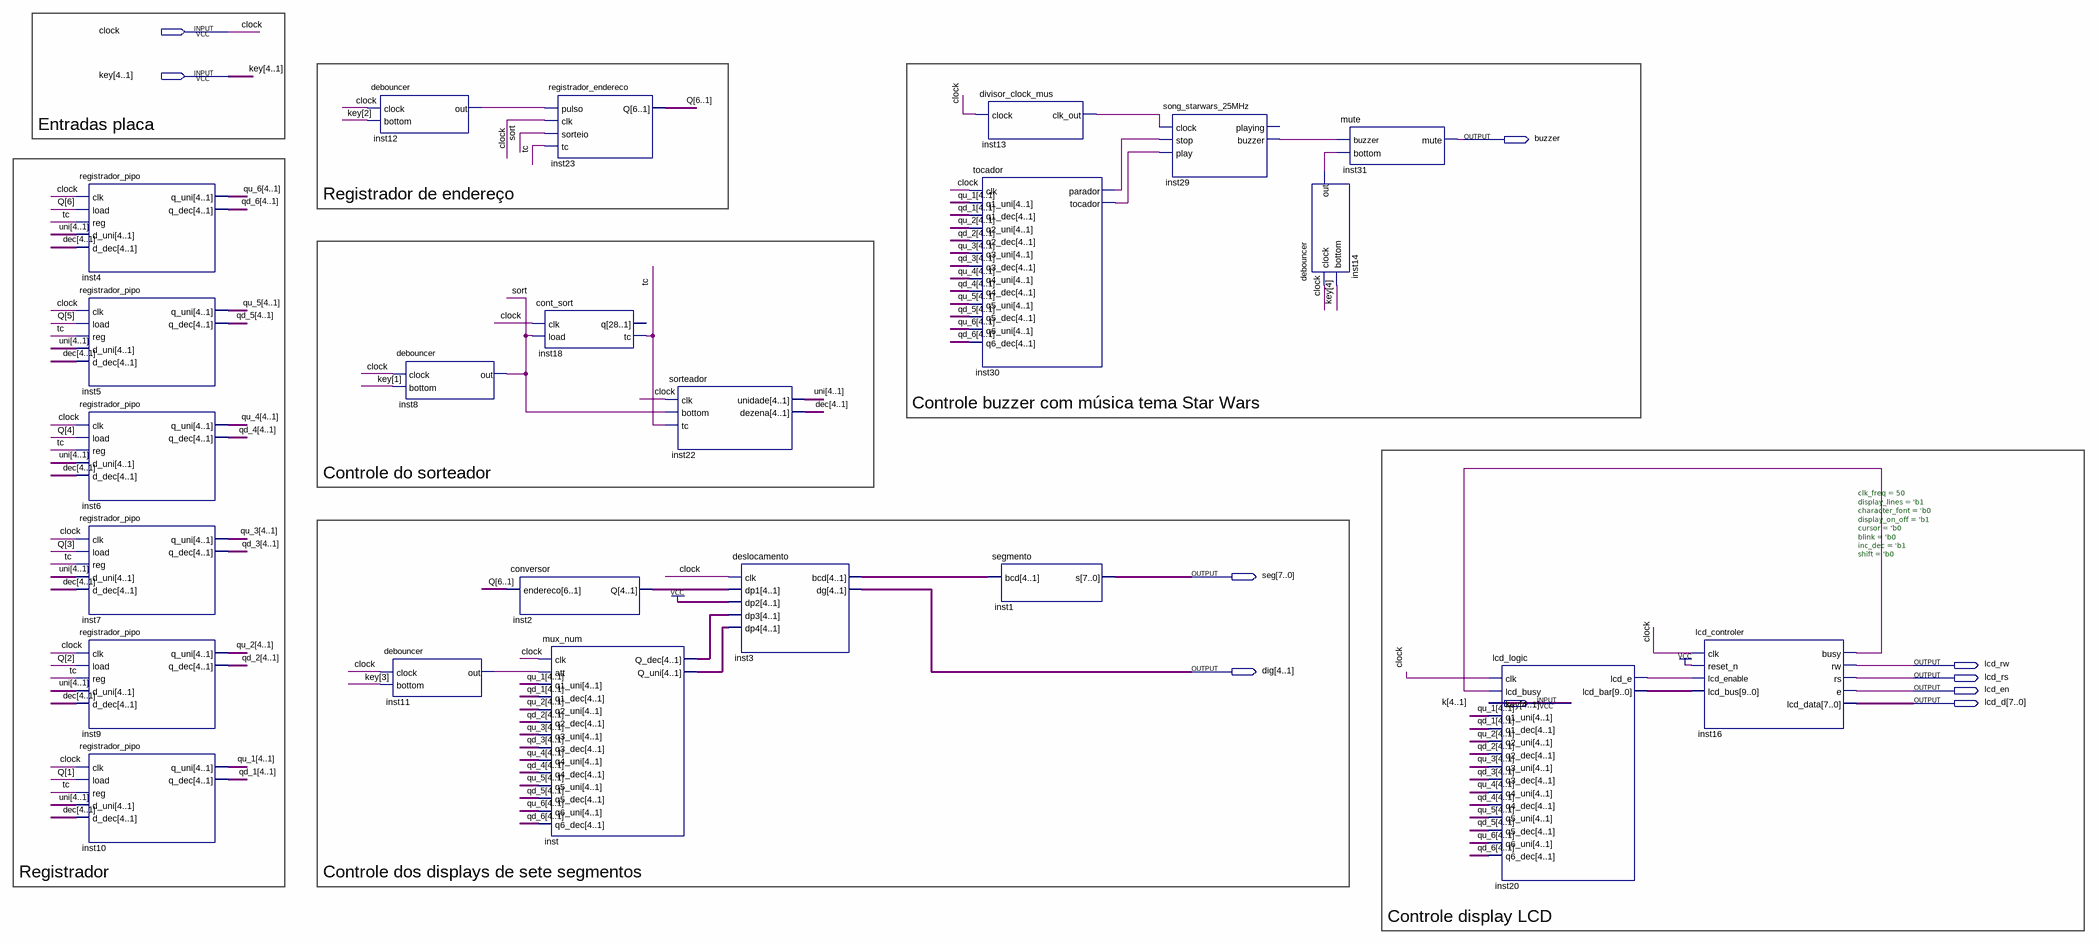
[diagram p0: schematic sheet]
// Quartus schematic Projeto2_bloco.bdf as structural Verilog: 23 symbols, 10 pins
module Projeto2_bloco (
  input  clock,
  input  [4:1] key,
  input  [4:1] k,
  output buzzer,
  output [7:0] seg,
  output lcd_rw,
  output [4:1] dig,
  output lcd_rs,
  output lcd_en,
  output [7:0] lcd_d
);

  wire inst11_out, inst12_out, inst13_clk_out, inst14_out, inst16_busy, inst20_lcd_e, inst29_buzzer,
       inst30_parador, inst30_tocador, sort, tc;
  wire [3:0] inst2_q, inst3_bcd, inst_q_dec, inst_q_uni;
  wire [4:1] dec, qd_1, qd_2, qd_3, qd_4, qd_5, qd_6, qu_1, qu_2, qu_3, qu_4, qu_5, qu_6, uni;
  wire [6:1] Q;
  wire [9:0] inst20_lcd_bar;

  registrador_pipo inst4 (.clk(clock), .load(Q[6]), .\reg (tc), .d_uni(uni), .d_dec(dec), .q_uni(qu_6), .q_dec(qd_6));
  registrador_pipo inst5 (.clk(clock), .load(Q[5]), .\reg (tc), .d_uni(uni), .d_dec(dec), .q_uni(qu_5), .q_dec(qd_5));
  registrador_pipo inst6 (.clk(clock), .load(Q[4]), .\reg (tc), .d_uni(uni), .d_dec(dec), .q_uni(qu_4), .q_dec(qd_4));
  registrador_pipo inst7 (.clk(clock), .load(Q[3]), .\reg (tc), .d_uni(uni), .d_dec(dec), .q_uni(qu_3), .q_dec(qd_3));
  registrador_pipo inst9 (.clk(clock), .load(Q[2]), .\reg (tc), .d_uni(uni), .d_dec(dec), .q_uni(qu_2), .q_dec(qd_2));
  registrador_pipo inst10 (.clk(clock), .load(Q[1]), .\reg (tc), .d_uni(uni), .d_dec(dec), .q_uni(qu_1), .q_dec(qd_1));
  debouncer inst12 (.clock(clock), .bottom(key[2]), .out(inst12_out));
  debouncer inst8 (.clock(clock), .bottom(key[1]), .out(sort));
  debouncer inst11 (.clock(clock), .bottom(key[3]), .out(inst11_out));
  conversor inst2 (.endereco(Q), .Q(inst2_q));
  registrador_endereco inst23 (.pulso(inst12_out), .clk(clock), .sorteio(sort), .tc(tc), .Q(Q));
  cont_sort inst18 (.clk(clock), .load(sort), .tc(tc));  // open: q
  mux_num inst (
    .clk(clock), .att(inst11_out), .q1_uni(qu_1), .q1_dec(qd_1), .q2_uni(qu_2), .q2_dec(qd_2), .q3_uni(qu_3),
    .q3_dec(qd_3), .q4_uni(qu_4), .q4_dec(qd_4), .q5_uni(qu_5), .q5_dec(qd_5), .q6_uni(qu_6), .q6_dec(qd_6),
    .Q_dec(inst_q_dec), .Q_uni(inst_q_uni));
  sorteador inst22 (.clk(clock), .bottom(sort), .tc(tc), .unidade(uni), .dezena(dec));
  deslocamento inst3 (
    .clk(clock), .dp1(inst2_q), .dp2(4'b1111), .dp3(inst_q_dec), .dp4(inst_q_uni), .bcd(inst3_bcd), .dg(dig));
  tocador inst30 (
    .clk(clock), .q1_uni(qu_1), .q1_dec(qd_1), .q2_uni(qu_2), .q2_dec(qd_2), .q3_uni(qu_3), .q3_dec(qd_3),
    .q4_uni(qu_4), .q4_dec(qd_4), .q5_uni(qu_5), .q5_dec(qd_5), .q6_uni(qu_6), .q6_dec(qd_6),
    .parador(inst30_parador), .tocador(inst30_tocador));
  divisor_clock_mus inst13 (.clock(clock), .clk_out(inst13_clk_out));
  segmento inst1 (.bcd(inst3_bcd), .s(seg));
  song_starwars_25MHz inst29 (
    .clock(inst13_clk_out), .stop(inst30_parador), .play(inst30_tocador), .buzzer(inst29_buzzer));  // open: playing
  debouncer inst14 (.clock(clock), .bottom(key[4]), .out(inst14_out));
  mute inst31 (.buzzer(inst29_buzzer), .bottom(inst14_out), .mute(buzzer));
  lcd_logic inst20 (
    .clk(clock), .lcd_busy(inst16_busy), .key(k), .q1_uni(qu_1), .q1_dec(qd_1), .q2_uni(qu_2), .q2_dec(qd_2),
    .q3_uni(qu_3), .q3_dec(qd_3), .q4_uni(qu_4), .q4_dec(qd_4), .q5_uni(qu_5), .q5_dec(qd_5), .q6_uni(qu_6),
    .q6_dec(qd_6), .lcd_e(inst20_lcd_e), .lcd_bar(inst20_lcd_bar));
  lcd_controler #(.clk_freq(50), .display_lines('b1), .character_font('b0), .display_on_off('b1), .cursor('b0), .blink('b0), .inc_dec('b1), .shift('b0)) inst16 (
    .clk(clock), .reset_n(1'b1), .lcd_enable(inst20_lcd_e), .lcd_bus(inst20_lcd_bar), .busy(inst16_busy),
    .rw(lcd_rw), .rs(lcd_rs), .e(lcd_en), .lcd_data(lcd_d));

  // Notes on the sheet:
  //   Entradas placa
  //   Registrador de endereço
  //   Controle buzzer com música tema Star Wars
  //   Controle do sorteador
  //   Registrador
  //   Controle dos displays de sete segmentos
  //   Controle display LCD
endmodule
